# Altium schematic sheet ESP_Trägerplatine.SchDoc
size A4; SheetNumber: 1; SheetTotal: 3
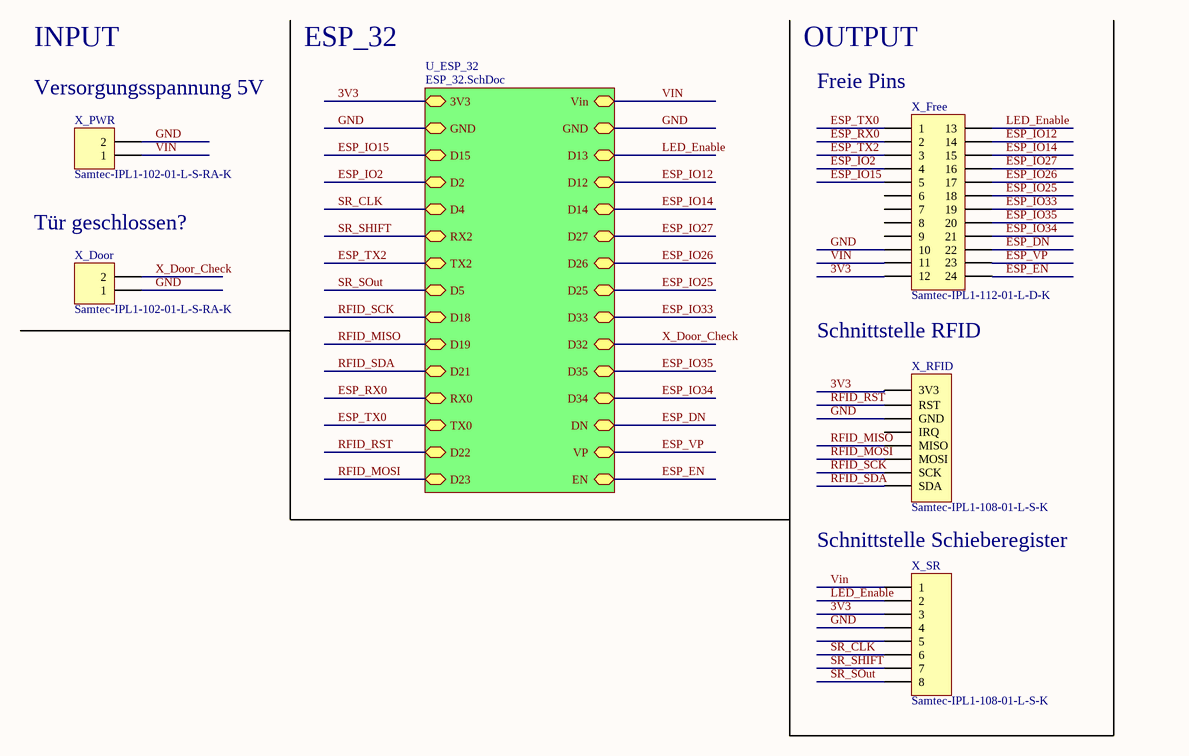
[diagram p0: ESP_Trägerplatine.SchDoc]

## Parts
X_Door  Samtec-IPL1-102-01-L-S-RA-K  [Samtec-IPL1-102-01-L-S-RA-K]
X_Free  Samtec-IPL1-112-01-L-D-K  [Samtec-IPL1-112-01-L-D-K]
X_PWR  Samtec-IPL1-102-01-L-S-RA-K  [Samtec-IPL1-102-01-L-S-RA-K]
X_RFID  Samtec-IPL1-108-01-L-S-K  [Samtec-IPL1-108-01-L-S-K]
X_SR  Samtec-IPL1-108-01-L-S-K  [Samtec-IPL1-108-01-L-S-K]

## Sub-sheets
U_ESP_32 = ESP_32.SchDoc: 3V3 (bidir), GND (bidir), D15 (bidir), D2 (bidir), D4 (bidir), RX2 (bidir), TX2 (bidir), D5 (bidir), D18 (bidir), D19 (bidir), D21 (bidir), RX0 (bidir), TX0 (bidir), D22 (bidir), D23 (bidir), Vin (bidir), GND (bidir), D13 (bidir), D12 (bidir), D14 (bidir), D27 (bidir), D26 (bidir), D25 (bidir), D33 (bidir), D32 (bidir), D35 (bidir), D34 (bidir), DN (bidir), VP (bidir), EN (bidir)

## Nets
3V3: X_Free.12 X_RFID.1(3V3) X_SR.3 ; sheet U_ESP_32/3V3
ESP_DN: X_Free.22 ; sheet U_ESP_32/DN
ESP_EN: X_Free.24 ; sheet U_ESP_32/EN
ESP_IO2: X_Free.4 ; sheet U_ESP_32/D2
ESP_IO12: X_Free.14 ; sheet U_ESP_32/D12
ESP_IO14: X_Free.15 ; sheet U_ESP_32/D14
ESP_IO15: X_Free.5 ; sheet U_ESP_32/D15
ESP_IO25: X_Free.18 ; sheet U_ESP_32/D25
ESP_IO26: X_Free.17 ; sheet U_ESP_32/D26
ESP_IO27: X_Free.16 ; sheet U_ESP_32/D27
ESP_IO33: X_Free.19 ; sheet U_ESP_32/D33
ESP_IO34: X_Free.21 ; sheet U_ESP_32/D34
ESP_IO35: X_Free.20 ; sheet U_ESP_32/D35
ESP_RX0: X_Free.2 ; sheet U_ESP_32/RX0
ESP_TX0: X_Free.1 ; sheet U_ESP_32/TX0
ESP_TX2: X_Free.3 ; sheet U_ESP_32/TX2
ESP_VP: X_Free.23 ; sheet U_ESP_32/VP
GND: X_Door.1 X_Free.10 X_PWR.2 X_RFID.3(GND) X_SR.4 ; sheet U_ESP_32/GND, sheet U_ESP_32/GND
LED_Enable: X_Free.13 X_SR.2 ; sheet U_ESP_32/D13
RFID_MISO: X_RFID.5(MISO) ; sheet U_ESP_32/D19
RFID_MOSI: X_RFID.6(MOSI) ; sheet U_ESP_32/D23
RFID_RST: X_RFID.2(RST) ; sheet U_ESP_32/D22
RFID_SCK: X_RFID.7(SCK) ; sheet U_ESP_32/D18
RFID_SDA: X_RFID.8(SDA) ; sheet U_ESP_32/D21
SR_CLK: X_SR.6 ; sheet U_ESP_32/D4
SR_SHIFT: X_SR.7 ; sheet U_ESP_32/RX2
SR_SOut: X_SR.8 ; sheet U_ESP_32/D5
VIN: X_Free.11 X_PWR.1 X_SR.1 ; sheet U_ESP_32/Vin
X_Door_Check: X_Door.2 ; sheet U_ESP_32/D32

Not connected (* = marked no-connect by the designer): X_Free 6 7 8 9; X_RFID 4(IRQ); X_SR 5

## Notes on the sheet
- INPUT
- (near X_PWR) Versorgungsspannung 5V
- ESP_32
- OUTPUT
- (near X_Free) Freie Pins
- Tür geschlossen?
- Schnittstelle RFID
- Schnittstelle Schieberegister

## Library data of the parts
X_Door X_PWR = Samtec-IPL1-102-01-L-S-RA-K: Samtec IPL1 .100", 2polig, eine Reihe, 90° gewinkelt; Manufacturer: Samtec; Part Number: IPL1-102-01-L-S-RA-K
X_Free = IPL1-112-01-L-D-K: Header, 12-Pin, Dual row; LatestRevisionDate: 17-Jul-2002; LatestRevisionNote: Re-released for DXP Platform.; Publisher: Altium Limited; Value: Samtec-IPL1-112-01-L-D-K
X_RFID = Samtec-IPL1-108-01-L-S-K: Samtec IPL1 .100", 8-polig, eine Reihe; Manufacturer: Samtec; Part Number: IPL1-108-01-L-S-K
X_SR = IPL1-108-01-L-S-K: Header, 8-Pin; LatestRevisionDate: 17-Jul-2002; LatestRevisionNote: Re-released for DXP Platform.; Publisher: Altium Limited; Value: Samtec-IPL1-108-01-L-S-K